# EAGLE schematic main (EAGLE 7.5.0)
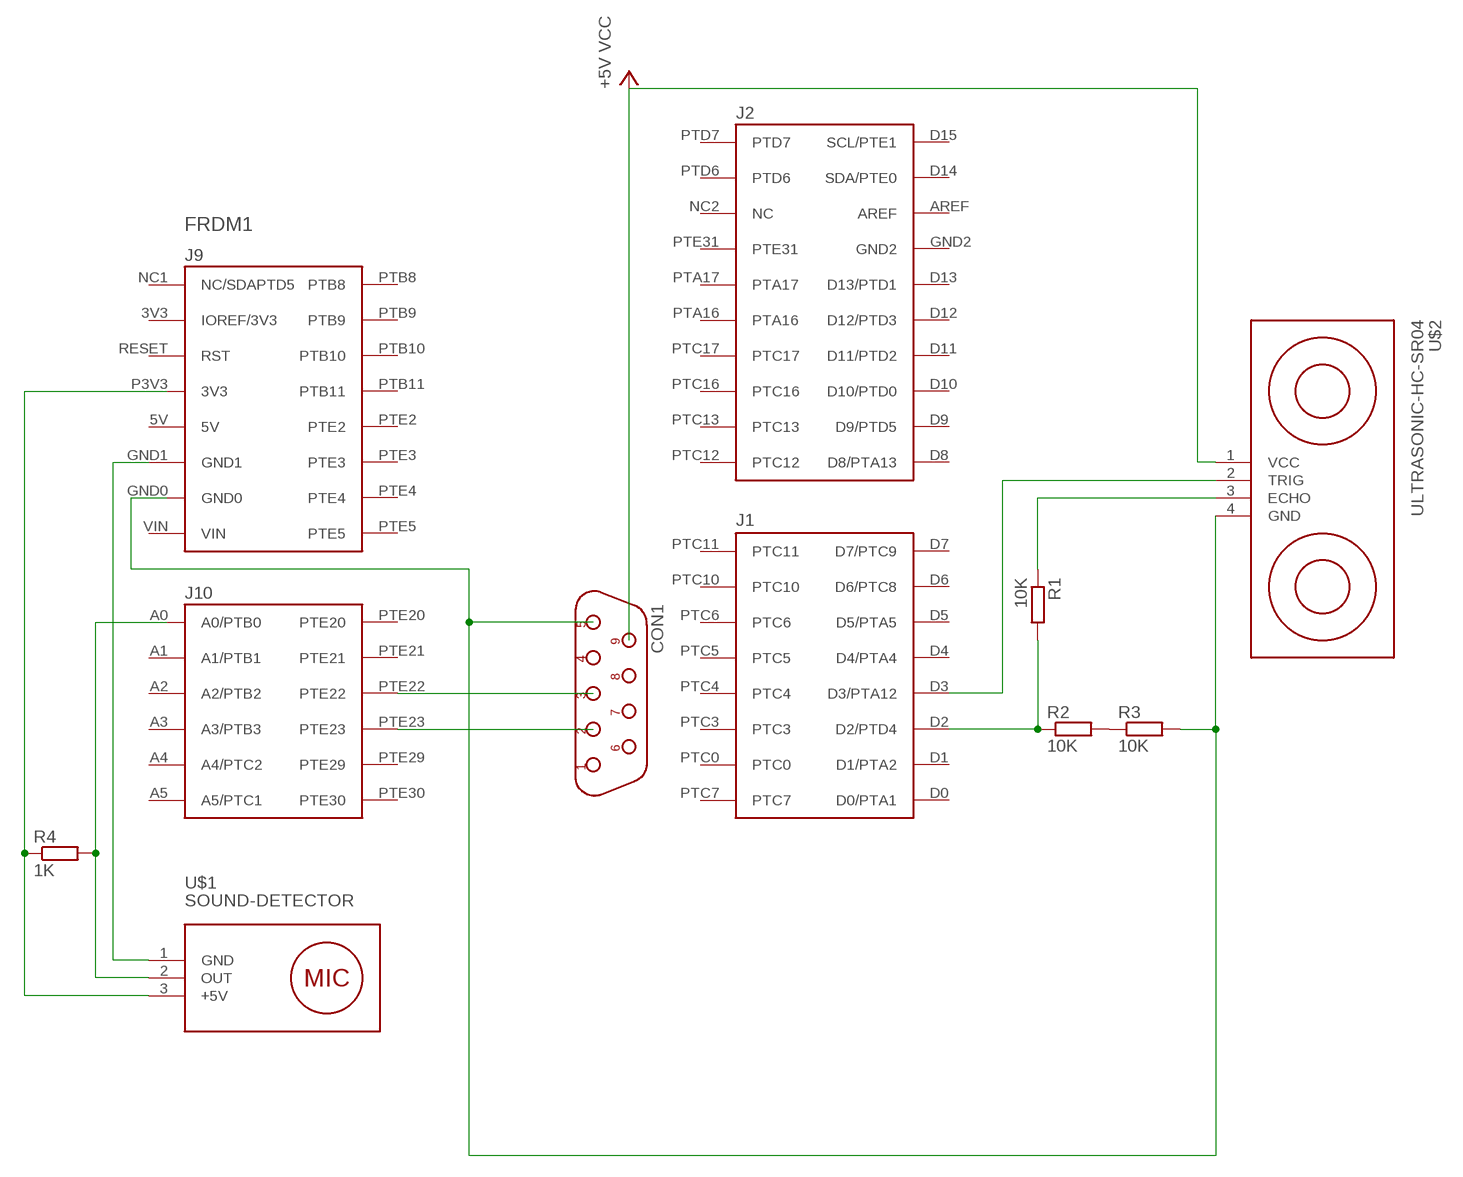
[diagram p0: schematic, sheet 1]

## Parts
CON1  DB9F  [D-09F]
FRDM1  FRDM-KL25ZNORMAL  [FRDM_KL25Z_NORMAL]
R1  10K  R-EU_0204/7  [0204/7]
R2  10K  R-EU_0204/7  [0204/7]
R3  10K  R-EU_0204/7  [0204/7]
R4  1K  R-EU_0204/7  [0204/7]
U$1  SOUND-DETECTOR  [SOUND-DETECTOR]
U$2  ULTRASONIC-HC-SR04  [ULTRASONIC-HC-SR04]

## Nets
N$2: FRDM1.D3(D3/PTA12) U$2.2(TRIG)
N$3: R1.1 U$2.3(ECHO)
N$4: FRDM1.D2(D2/PTD4) R1.2 R2.1
N$5: R2.2 R3.1
N$6: CON1.5 R3.2 U$2.4(GND)
N$7: R4.2 U$1.2(OUT)
N$8: R4.1 U$1.3(+5V)
N$9: FRDM1.GND1 U$1.1(GND)
N$10: CON1.3 FRDM1.PTE22
N$12: CON1.2 FRDM1.PTE23
VCC: CON1.9 U$2.1(VCC) ; supply symbol labelled +5V VCC
Unconnected: CON1.1 CON1.4 CON1.6 CON1.7 CON1.8 FRDM1.3V3(IOREF/3V3) FRDM1.5V FRDM1.A0(A0/PTB0) FRDM1.A1(A1/PTB1) FRDM1.A2(A2/PTB2) FRDM1.A3(A3/PTB3) FRDM1.A4(A4/PTC2) FRDM1.A5(A5/PTC1) FRDM1.AREF FRDM1.D0(D0/PTA1) FRDM1.D1(D1/PTA2) FRDM1.D4(D4/PTA4) FRDM1.D5(D5/PTA5) FRDM1.D6(D6/PTC8) FRDM1.D7(D7/PTC9) FRDM1.D8(D8/PTA13) FRDM1.D9(D9/PTD5) FRDM1.D10(D10/PTD0) FRDM1.D11(D11/PTD2) FRDM1.D12(D12/PTD3) FRDM1.D13(D13/PTD1) FRDM1.D14(SDA/PTE0) FRDM1.D15(SCL/PTE1) FRDM1.GND0 FRDM1.GND2 FRDM1.NC1(NC/SDAPTD5) FRDM1.NC2(NC) FRDM1.P3V3(3V3) FRDM1.PTA16 FRDM1.PTA17 FRDM1.PTB8 FRDM1.PTB9 FRDM1.PTB10 FRDM1.PTB11 FRDM1.PTC0 FRDM1.PTC3 FRDM1.PTC4 FRDM1.PTC5 FRDM1.PTC6 FRDM1.PTC7 FRDM1.PTC10 FRDM1.PTC11 FRDM1.PTC12 FRDM1.PTC13 FRDM1.PTC16 FRDM1.PTC17 FRDM1.PTD6 FRDM1.PTD7 FRDM1.PTE2 FRDM1.PTE3 FRDM1.PTE4 FRDM1.PTE5 FRDM1.PTE20 FRDM1.PTE21 FRDM1.PTE29 FRDM1.PTE30 FRDM1.PTE31 FRDM1.RESET(RST) FRDM1.VIN

## Library data of the parts
CON1 = connect:DB9F
FRDM1 = Freedom:FRDM-KL25Z: For creating FRDM-KL25Z shields
R1-R4 = resistor:R-EU_: RESISTOR, European symbol
U$1 = diy-modules:SOUND-DETECTOR: Sound Detection Module
U$2 = diy-modules:ULTRASONIC-HC-SR04: Ultrasonic Ranging Module HC-SR04 More details available here: http://randomnerdtutorials.com/complete-guide-for-ultrasonic-sensor-hc-sr04/ Click here to find device on ebay.com <http://www.ebay.com/sch/hc+sr04+ultrasonic>